# EAGLE design NXMaus (EAGLE 7.2.0)
AUTHOR: M. Petrilak; VERSION: 01
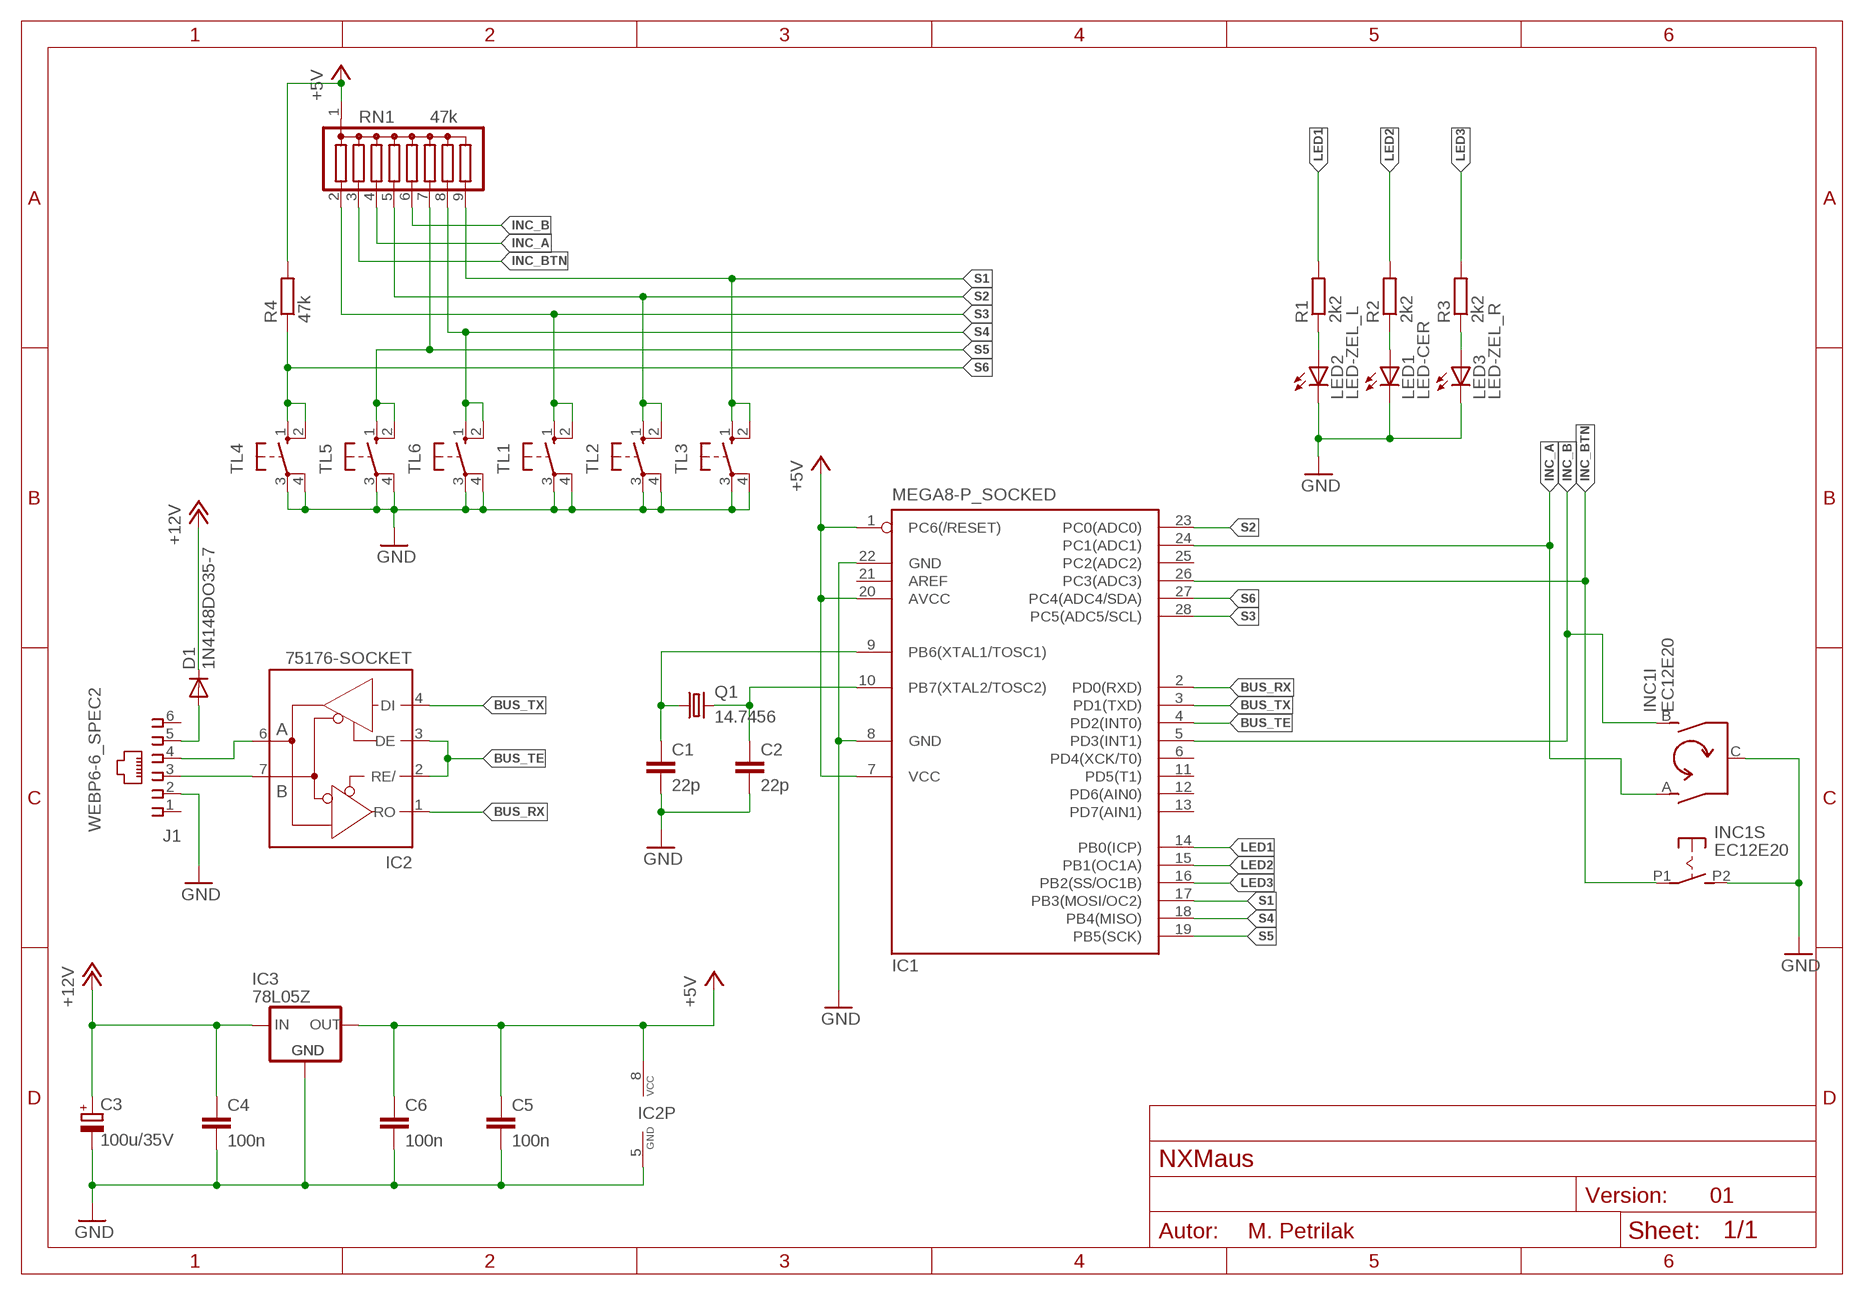
[diagram p0: schematic, sheet 1]

## Parts
C1  22p  C-EU025_050-025X075  [C025_050-025X075]
C2  22p  C-EU025_050-025X075  [C025_050-025X075]
C3  100u/35V  CPOL-EUE2.5-6  [E2,5-6]
C4  100n  C-EU025_050-025X075  [C025_050-025X075]
C5  100n  C-EU025_050-025X075  [C025_050-025X075]
C6  100n  C-EU025_050-025X075  [C025_050-025X075]
D1  1N4148DO35-7  [DO35-7]
IC1  MEGA8-P_SOCKED  [SOKL-28U]
IC2  75176-SOCKET  [SOCKET-08]
IC3  78L05Z  [TO92]
INC1  EC12E20  [EC12E20]
J1  WEBP6-6_SPEC2  [WEBP6-6_SPEC2]
LED1  LED-CER  LED3MM  [LED3MM]
LED2  LED-ZEL_L  LED3MM  [LED3MM]
LED3  LED-ZEL_R  LED3MM  [LED3MM]
Q1  14.7456  XTAL  [HC49U70]
R1  2k2  R-EU_0207/10  [0207/10]
R2  2k2  R-EU_0207/10  [0207/10]
R3  2k2  R-EU_0207/10  [0207/10]
R4  47k  R-EU_R1206  [R1206]
RN1  47k  G08R  [SIL9]
TL1  10-XX  [B3F-10XX]
TL2  10-XX  [B3F-10XX]
TL3  10-XX  [B3F-10XX]
TL4  10-XX  [B3F-10XX]
TL5  10-XX  [B3F-10XX]
TL6  10-XX  [B3F-10XX]

## Nets
+5V: C5.1 C6.1 IC1.1(PC6(/RESET)) IC1.7(VCC) IC1.20(AVCC) IC2.8(VCC) IC3.1(VO) R4.2 RN1.1
+12V: C3.+ C4.1 D1.C IC3.3(VI)
BUS_A: IC2.6(A) J1.4
BUS_B: IC2.7(B) J1.3
BUS_RX: IC1.2(PD0(RXD)) IC2.1(RO)
BUS_TE: IC1.4(PD2(INT0)) IC2.2(RE/) IC2.3(DE)
BUS_TX: IC1.3(PD1(TXD)) IC2.4(DI)
GND: C1.2 C1.3 C2.2 C2.3 C3.- C4.2 C4.3 C5.2 C5.3 C6.2 C6.3 IC1.8(GND) IC1.22(GND) IC2.5(GND) IC3.2(GND) INC1.C(I:C) INC1.P2(S:S) J1.2 LED1.K(C) LED2.K(C) LED3.K(C) TL1.3(P) TL1.4(P1) TL2.3(P) TL2.4(P1) TL3.3(P) TL3.4(P1) TL4.3(P) TL4.4(P1) TL5.3(P) TL5.4(P1) TL6.3(P) TL6.4(P1)
INC_A: IC1.24(PC1(ADC1)) INC1.A(I:A) RN1.4
INC_B: IC1.5(PD3(INT1)) INC1.B(I:B) RN1.6
INC_BTN: IC1.26(PC3(ADC3)) INC1.P1(S:P) RN1.3
LED1: IC1.14(PB0(ICP)) R1.2
LED2: IC1.15(PB1(OC1A)) R2.2
LED3: IC1.16(PB2(SS/OC1B)) R3.2
N$2: D1.A J1.5
N$3: LED3.A R3.1
N$4: LED1.A R2.1
N$5: C1.1 IC1.9(PB6(XTAL1/TOSC1)) Q1.1
N$6: C2.1 IC1.10(PB7(XTAL2/TOSC2)) Q1.2
N$7: LED2.A R1.1
S1: IC1.17(PB3(MOSI/OC2)) RN1.9 TL3.1(S) TL3.2(S1)
S2: IC1.23(PC0(ADC0)) RN1.5 TL2.1(S) TL2.2(S1)
S3: IC1.28(PC5(ADC5/SCL)) RN1.2 TL1.1(S) TL1.2(S1)
S4: IC1.18(PB4(MISO)) RN1.8 TL6.1(S) TL6.2(S1)
S5: IC1.19(PB5(SCK)) RN1.7 TL5.1(S) TL5.2(S1)
S6: IC1.27(PC4(ADC4/SDA)) R4.1 TL4.1(S) TL4.2(S1)
Unconnected: IC1.6(PD4(XCK/T0)) IC1.11(PD5(T1)) IC1.12(PD6(AIN0)) IC1.13(PD7(AIN1)) IC1.21(AREF) IC1.25(PC2(ADC2)) J1.1 J1.6

## Library data of the parts
C1 C2 C4-C6 = rcl:C-EU: CAPACITOR, European symbol
C3 = rcl:CPOL-EU: POLARIZED CAPACITOR, European symbol
D1 = diode:1N4148: DIODE high speed (Philips)
IC1 = atmel:MEGA8-P: MICROCONTROLLER 8 Kbytes FLASH, 1 kbytes SRAM, 512 bytes EEPROM, USART, 4-channel 10 bit ADC, 2-channel 8 bit ADC Pin compatible with Atmega48, ATMega88, ATMega168 Source: avr.lbr
IC2 = maxim:75176
IC3 = linear:78*: Positive VOLTAGE REGULATOR Source: http://cache.national.com/ds/LM/LM78L05.pdf http://www.fairchildsemi.com/ds/LM/LM7805.pdf
INC1 = my:EC12E20
J1 = con-malina:WEBP6-6
LED1-LED3 = led:LED: LED OSRAM: - CHIPLED LG R971, LG N971, LY N971, LG Q971, LY Q971, LO R971, LY R971 LH N974, LH R974 LS Q976, LO Q976, LY Q976 LO Q996 - Hyper CHIPLED LW Q18S LB Q993, LB Q99A, LB R99A - SideLED LS A670, LO A670, LY A670, LG A670, LP A670 LB A673, LV A673, LT A673, LW A673 LH A674 LY A675 LS A676, LA A676, LO A676, LY A676, LW A676 LS A679, LY A679, LG A679 - Hyper Micro SIDELED® LS Y876, LA Y876, LO Y876, LY Y876 LT Y87S - SmartLED LW L88C, LW L88S LB L89C, LB L89S, LG L890 LS L89K, LO L89K, LY L89K LS L896, LA L896, LO L896, LY L896 - TOPLED LS T670, LO T670, LY T670, LG T670, LP T670 LSG T670, LSP T670, LSY T670, LOP T670, LYG T670 LG T671, LOG T671, LSG T671 LB T673, LV T673, LT T673, LW T673 LH T674 LS T676, LA T676, LO T676, LY T676, LB T676, LH T676, LSB T676, LW T676 LB T67C, LV T67C, LT T67C, LS T67K, LO T67K, LY T67K, LW E67C LS E67B, LA E67B, LO E67B, LY E67B, LB E67C, LV E67C, LT E67C LW T67C LS T679, LY T679, LG T679 LS T770, LO T770, LY T770, LG T770, LP T770 LB T773, LV T773, LT T773, LW T773 LH T774 LS E675, LA E675, LY E675, LS T675 LS T776, LA T776, LO T776, LY T776, LB T776 LHGB T686 LT T68C, LB T68C - Hyper Mini TOPLED® LB M676 - Mini TOPLED Santana® LG M470 LS M47K, LO M47K, LY M47K Source: http://www.osram.convergy.de LUXEON: - LUMILED® LXK2-PW12-R00, LXK2-PW12-S00, LXK2-PW14-U00, LXK2-PW14-V00 LXK2-PM12-R00, LXK2-PM12-S00, LXK2-PM14-U00 LXK2-PE12-Q00, LXK2-PE12-R00, LXK2-PE12-S00, LXK2-PE14-T00, LXK2-PE14-U00 LXK2-PB12-K00, LXK2-PB12-L00, LXK2-PB12-M00, LXK2-PB14-N00, LXK2-PB14-P00, LXK2-PB14-Q00 LXK2-PR12-L00, LXK2-PR12-M00, LXK2-PR14-Q00, LXK2-PR14-R00 LXK2-PD12-Q00, LXK2-PD12-R00, LXK2-PD12-S00 LXK2-PH12-R00, LXK2-PH12-S00 LXK2-PL12-P00, LXK2-PL12-Q00, LXK2-PL12-R00 Source: www.luxeon.com KINGBRIGHT: KA-3528ASYC Source: www.kingbright.com
Q1 = crystal:XTAL
R1-R4 = rcl:R-EU_: RESISTOR, European symbol
RN1 = resistor-sil:G08R: SIL RESISTOR
TL1-TL6 = switch-omron:10-XX: OMRON SWITCH

## Board
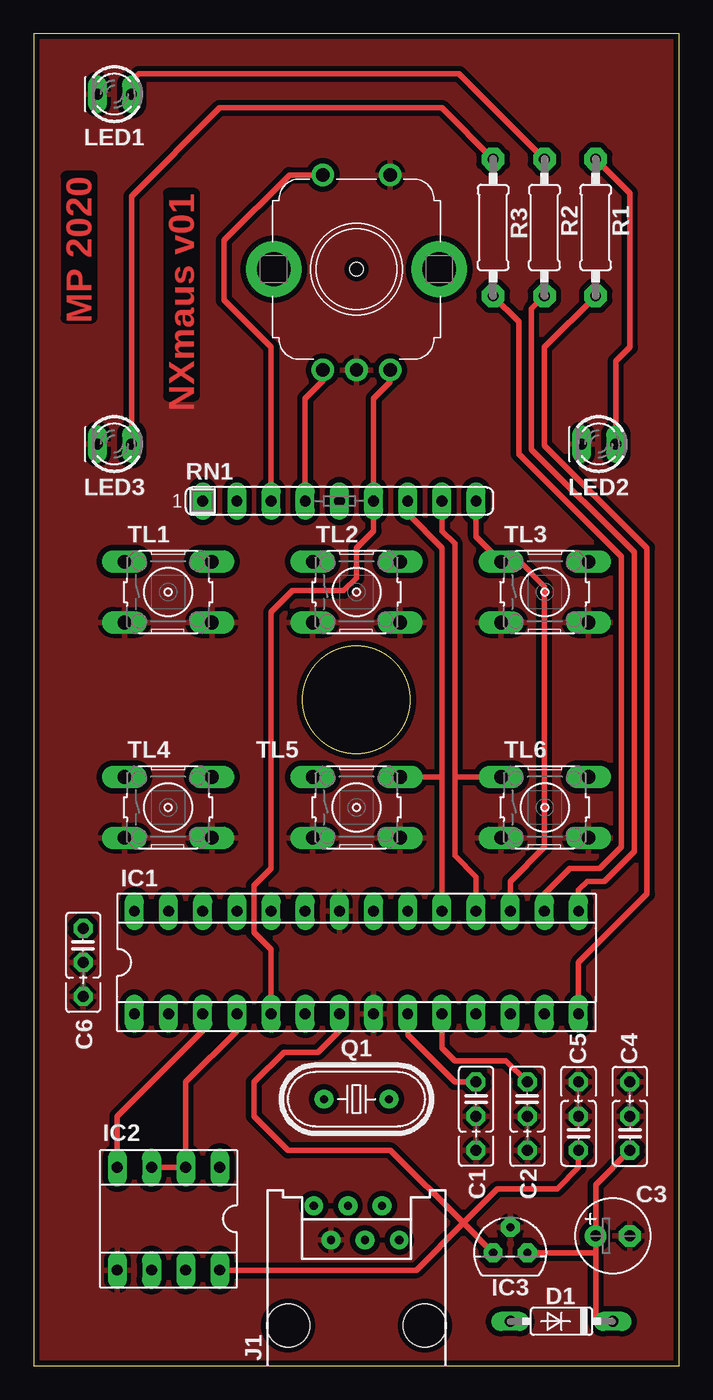
[diagram p1: board, top side]
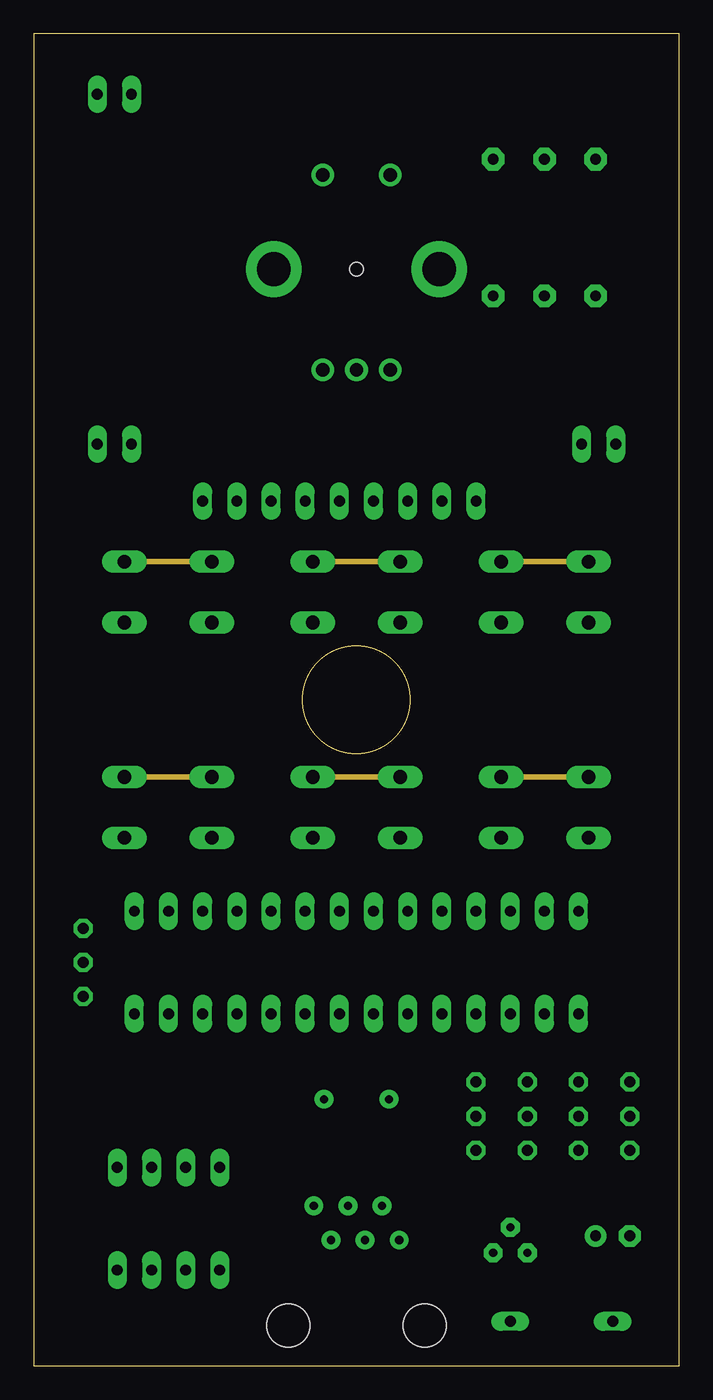
[diagram p2: board, inner layer Route2]
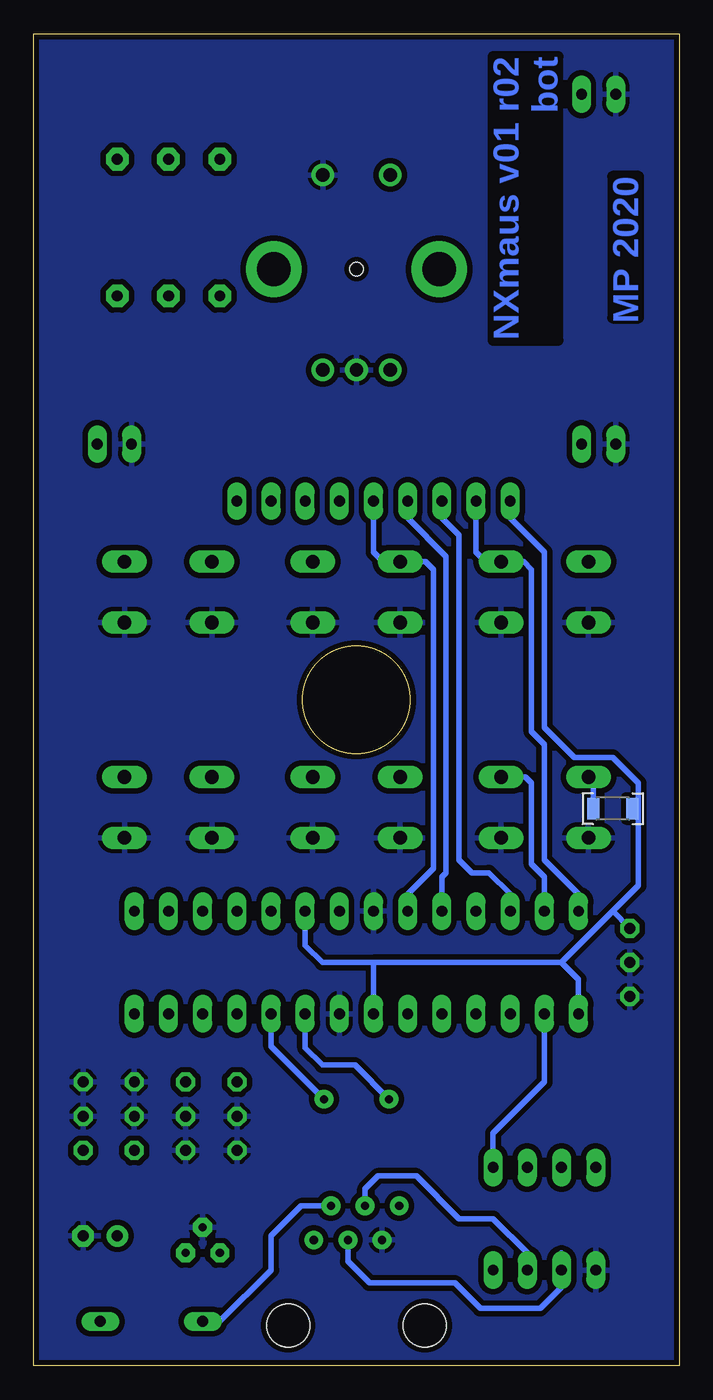
[diagram p3: board, bottom side, seen from below]

Size 48 x 99 mm. Coordinates in mm from the lower left corner, seen from the top.
Outline: 0,0 48,0 48,99 0,99 0,0
Outline: circle at 24,49.5 radius 4
Copper layers (1*2*16): Top 0.035mm / dielectric 0.095mm / Route2 0.035mm / dielectric 1.4mm / Bottom 0.035mm
Design rules "cina_navrh2 *": minimum track width 0.2mm, minimum drill 0.3mm, track to track 0.4mm, track to pad 0.3mm, pad to pad 0.3mm, via to via 0.3mm, smd to smd 0mil, copper to edge 0.4mm, drill to drill 0.5mm, minimum pad ring 0.3mm, minimum via ring 0.3mm, stop-mask expansion 0.1mm, vias tented up to drill 0.8mm, thermal gap 0.3mm

### Footprints (pad centres in the part's own frame; a part is rotated, then mirrored left to right if it is on the bottom)
C025_050-025X075 = drill 0.813 octagon: 1 -1.27,0; 2 1.27,0; 3 3.81,0
E2,5-6 = drill 0.8 pad 1.6: + -1.27,0 | drill 0.8 pad 1.6 octagon: - 1.27,0
DO35-7 = drill 0.813 long: A 3.81,0; C -3.81,0
SOKL-28U = drill 0.813 long: 1 -16.51,-3.81; 2 -13.97,-3.81; 3 -11.43,-3.81; 4 -8.89,-3.81; 5 -6.35,-3.81; 6 -3.81,-3.81; 7 -1.27,-3.81; 8 1.27,-3.81; 9 3.81,-3.81; 10 6.35,-3.81; 11 8.89,-3.81; 12 11.43,-3.81; 13 13.97,-3.81; 14 16.51,-3.81; 15 16.51,3.81; 16 13.97,3.81; 17 11.43,3.81; 18 8.89,3.81; 19 6.35,3.81; 20 3.81,3.81; 21 1.27,3.81; 22 -1.27,3.81; 23 -3.81,3.81; 24 -6.35,3.81; 25 -8.89,3.81; 26 -11.43,3.81; 27 -13.97,3.81; 28 -16.51,3.81
SOCKET-08 = drill 0.813 long: 1 -3.81,-3.81; 2 -1.27,-3.81; 3 1.27,-3.81; 4 3.81,-3.81; 5 3.81,3.81; 6 1.27,3.81; 7 -1.27,3.81; 8 -3.81,3.81
TO92 = drill 0.6 pad 1.4 octagon: 1 -1.27,0; 2 0,1.905; 3 1.27,0
EC12E20 = drill 1 pad 1.676: A -2.5,-7.5; B 2.5,-7.5; C 0,-7.5; P1 -2.5,7; P2 2.5,7 | drill 2.5: S -6.15,0; S_2 6.15,0 | hole 1: 0,0
WEBP6-6_SPEC2 = drill 0.6 pad 1.4: 1 -3.175,8.89; 2 -1.905,6.35; 3 -0.635,8.89; 4 0.635,6.35; 5 1.905,8.89; 6 3.175,6.35 | hole 3.2: -5.08,0; 5.08,0
LED3MM = drill 0.8 pad 1.4 long: A -1.27,0; K 1.27,0
HC49U70 = drill 0.6 pad 1.4: 1 -2.413,0; 2 2.413,0
0207/10 = drill 0.8 pad 1.676 octagon: 1 -5.08,0; 2 5.08,0
R1206 = smd 0.9 x 1.6: 1 -1.45,0; 2 1.45,0
SIL9 = drill 0.8 pad 1.4 long: 1 -10.16,0; 2 -7.62,0; 3 -5.08,0; 4 -2.54,0; 5 0,0; 6 2.54,0; 7 5.08,0; 8 7.62,0; 9 10.16,0
B3F-10XX = drill 1.016 long: 1 -3.251,2.261; 2 3.251,2.261; 3 -3.251,-2.261; 4 3.251,-2.261

### Placement (x,y rotation side)
C1  32.89,19.82 270 top
C2  36.7,19.82 270 top
C3  43.05,9.66 0 top
C4  44.32,17.28 90 top
C5  40.51,17.28 90 top
C6  3.68,31.25 270 top
D1  39.24,3.31 180 top
IC1  24,29.98 0 top
IC2  10.03,10.93 180 top
IC3  35.43,8.39 0 top
INC1  24,81.5 0 top
J1  24,3 0 top
LED1  6,94.5 180 top
LED2  42,68.5 180 top
LED3  6,68.5 180 top
Q1  24,19.82 0 top
R1  41.78,84.59 270 top
R2  37.97,84.59 270 top
R3  34.16,84.59 270 top
R4  4.95,41.41 0 bottom
RN1  22.73,64.27 0 top
TL1  10,57.5 0 top
TL2  24,57.5 0 top
TL3  38,57.5 0 top
TL4  10,41.5 0 top
TL5  24,41.5 0 top
TL6  38,41.5 0 top

### Tracks (layer width: path | path; a pad name or v marks a point on that pad's centre or on a via)
+5V
  Top 0.406: 31.94,10.61 34.48,13.15 38.92,13.15 40.51,14.74 C5.1 | IC1.7 22.73,24.9 21.14,23.31 18.6,23.31 16.38,21.09 16.38,18.55 18.92,16.01 26.54,16.01 31.94,10.61 | IC2.8 28.45,7.12 31.94,10.61 | 31.94,10.61 IC3.1
  Bottom 0.406: IC1.1 7.49,28.71 8.76,29.98 | 8.76,29.98 22.73,29.98 | 22.73,29.98 IC1.7 | IC1.20 27.81,31.25 26.54,29.98 22.73,29.98 | 8.76,29.98 4.95,33.79 | 4.95,33.79 3.05,35.7 3.05,42.05 | C6.1 4.95,33.79 | RN1.1 12.57,63 10.03,60.46 10.03,47.44 7.81,45.22 4.95,45.22 3.05,43.31 3.05,42.05 | R4.2 3.05,42.05
+12V
  Top 0.406: IC3.3 41.78,8.39 | D1.C 41.78,3.31 41.78,8.39 | 41.78,8.39 C3.+ 41.78,13.47 C4.1
BUS_A
  Bottom 0.406: 8.76,8.39 IC2.6 8.76,5.85 10.35,4.26 14.79,4.26 16.7,6.17 23.05,6.17 24.64,7.76 J1.4
BUS_B
  Bottom 0.406: J1.3 23.36,13.15 22.41,14.11 19.55,14.11 16.38,10.93 13.84,10.93 11.3,8.39 IC2.7
BUS_RX
  Bottom 0.406: IC1.2 10.03,21.09 13.84,17.28 IC2.1
BUS_TE
  Top 0.406: IC2.3 IC2.2 11.3,21.09 15.11,24.9 IC1.4
BUS_TX
  Top 0.406: IC1.3 12.57,24.9 6.22,18.55 IC2.4
GND
  pour Top: 0,0 48,0 48,99 0,99
  pour Bottom: 0,0 48,0 48,99 0,99
INC_A
  Top 0.406: RN1.4 20.19,71.89 21.5,73.2 INC1.A
  Bottom 0.406: IC1.24 17.65,36.33 17.33,36.65 17.33,60.14 20.19,63 RN1.4
INC_B
  Top 0.406: IC1.5 17.65,30.93 16.38,32.2 16.38,35.7 17.65,36.97 17.65,56.02 19.24,57.6 23.05,57.6 24,58.55 24,60.78 25.27,62.05 RN1.6 25.27,71.89 26.5,73.12 INC1.B
INC_BTN
  Top 0.406: RN1.3 17.65,75.7 14.16,79.19 14.16,83.64 19.02,88.5 INC1.P1
  Bottom 0.406: IC1.26 12.57,35.06 14.16,36.65 15.43,36.65 16.38,37.6 16.38,61.73 17.65,63 RN1.3
LED1
  Top 0.406: IC1.14 40.51,29.98 45.59,35.06 45.59,60.78 37.97,68.4 37.97,75.7 R1.2
LED2
  Top 0.406: 40.51,34.11 IC1.15 40.51,35.38 41.14,36.01 42.41,36.01 44.64,38.23 44.64,60.46 37.02,68.08 37.02,78.56 R2.2
LED3
  Top 0.406: R3.2 36.06,77.61 36.06,67.76 43.69,60.14 43.69,38.55 42.1,36.97 39.88,36.97 37.97,35.06 IC1.16
N$2
  Bottom 0.406: J1.5 28.12,11.89 30.35,9.66 30.35,7.12 34.16,3.31 D1.A
N$3
  Top 0.406: R3.1 30.35,93.48 13.84,93.48 7.27,86.91 LED3.A
N$4
  Top 0.406: R2.1 31.62,96.02 7.81,96.02 7.27,95.48 LED1.A
N$5
  Top 0.406: C1.1 31.3,21.09 27.81,24.58 IC1.9
  Bottom 0.406: Q1.1 24.13,22.36 26.54,22.36 27.81,23.63 IC1.9
N$6
  Top 0.406: C2.1 35.11,22.68 31.3,22.68 30.35,23.63 IC1.10
  Bottom 0.406: Q1.2 30.35,23.76 IC1.10
N$7
  Top 0.406: R1.1 44.32,87.13 44.32,75.7 43.27,74.65 LED2.A
S1
  Top 0.406: IC1.17 35.43,36.01 37.97,38.55 37.97,57.92 36.13,59.76 TL3.1 32.89,61.62 RN1.9
  Route2 0.406: TL3.1 TL3.2
S2
  Route2 0.406: TL2.1 TL2.2
  Bottom 0.406: IC1.23 20.19,35.06 18.29,36.97 18.29,59.19 18.86,59.76 TL2.1 22.03,59.76 22.73,60.46 RN1.5
S3
  Route2 0.406: TL1.1 TL1.2
  Bottom 0.406: IC1.28 7.49,35.06 10.03,37.6 10.03,46.17 10.98,47.12 10.98,59.19 11.55,59.76 TL1.2 14.41,59.76 15.11,60.46 RN1.2
S4
  Top 0.406: IC1.18 32.89,36.33 31.3,37.92 31.3,43.63 | 31.3,43.63 31.3,61.09 30.35,62.05 RN1.8 | 31.3,43.63 31.43,43.76 TL6.1
  Route2 0.406: TL6.2 TL6.1
S5
  Top 0.406: RN1.7 27.81,63.32 30.35,60.78 30.35,43.63 | 30.35,43.63 IC1.19 | 30.35,43.63 30.22,43.76 TL5.2
  Route2 0.406: TL5.1 TL5.2
S6
  Route2 0.406: TL4.1 TL4.2
  Bottom 0.406: IC1.27 10.03,36.33 10.98,37.28 10.98,43.31 11.43,43.76 TL4.2 | R4.1 6.4,43.41 TL4.1

### Text on the board
Top: MP 2020 | NXmaus v01
Bottom: NXmaus v01 r02 / bot | MP 2020
Document: F0 | STOP | F1 | F2 | F3